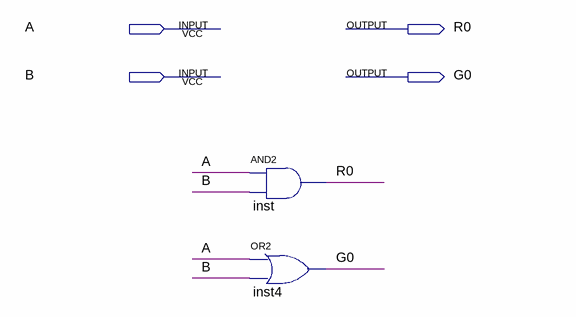
[diagram p0: schematic sheet]
// Quartus schematic GateDelay.bdf as structural Verilog: 2 symbols, 4 pins
module GateDelay (
  input  A,
  input  B,
  output R0,
  output G0
);

  and inst (R0, A, B);
  or inst4 (G0, A, B);
endmodule
